# Altium schematic sheet TimerModule.SchDoc
size A1
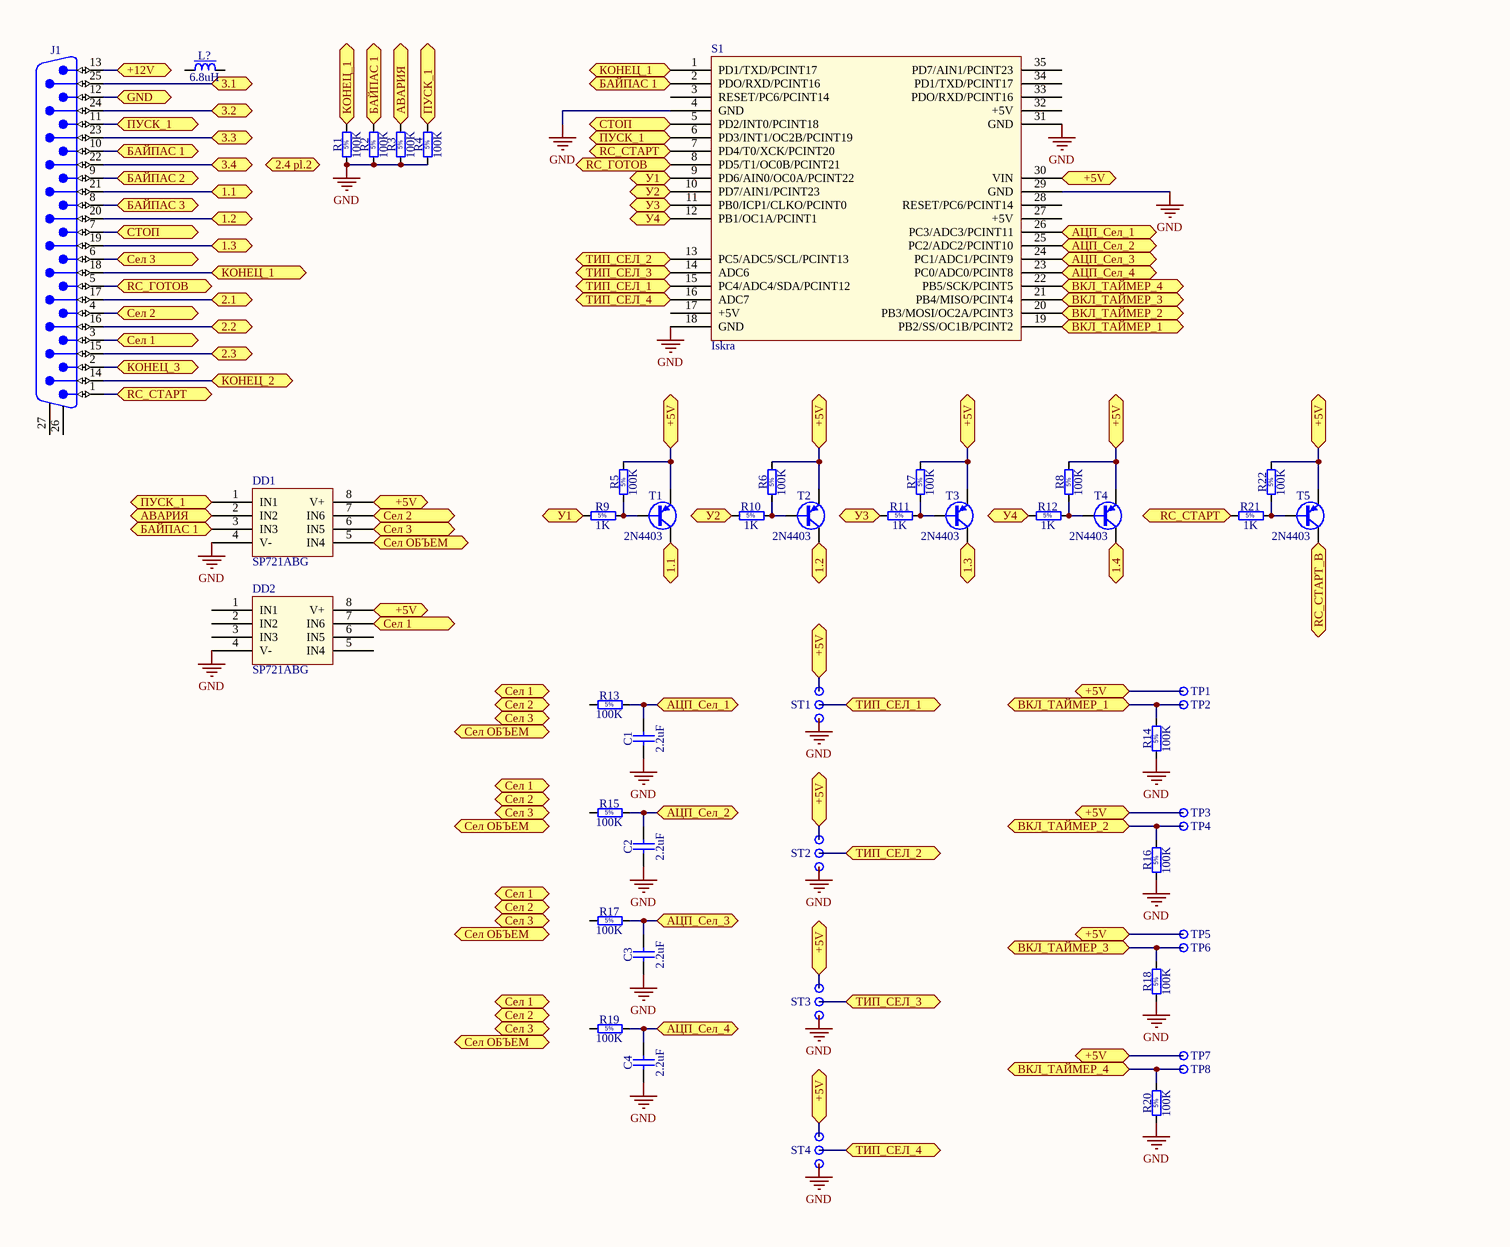
[diagram p0: TimerModule.SchDoc, left]
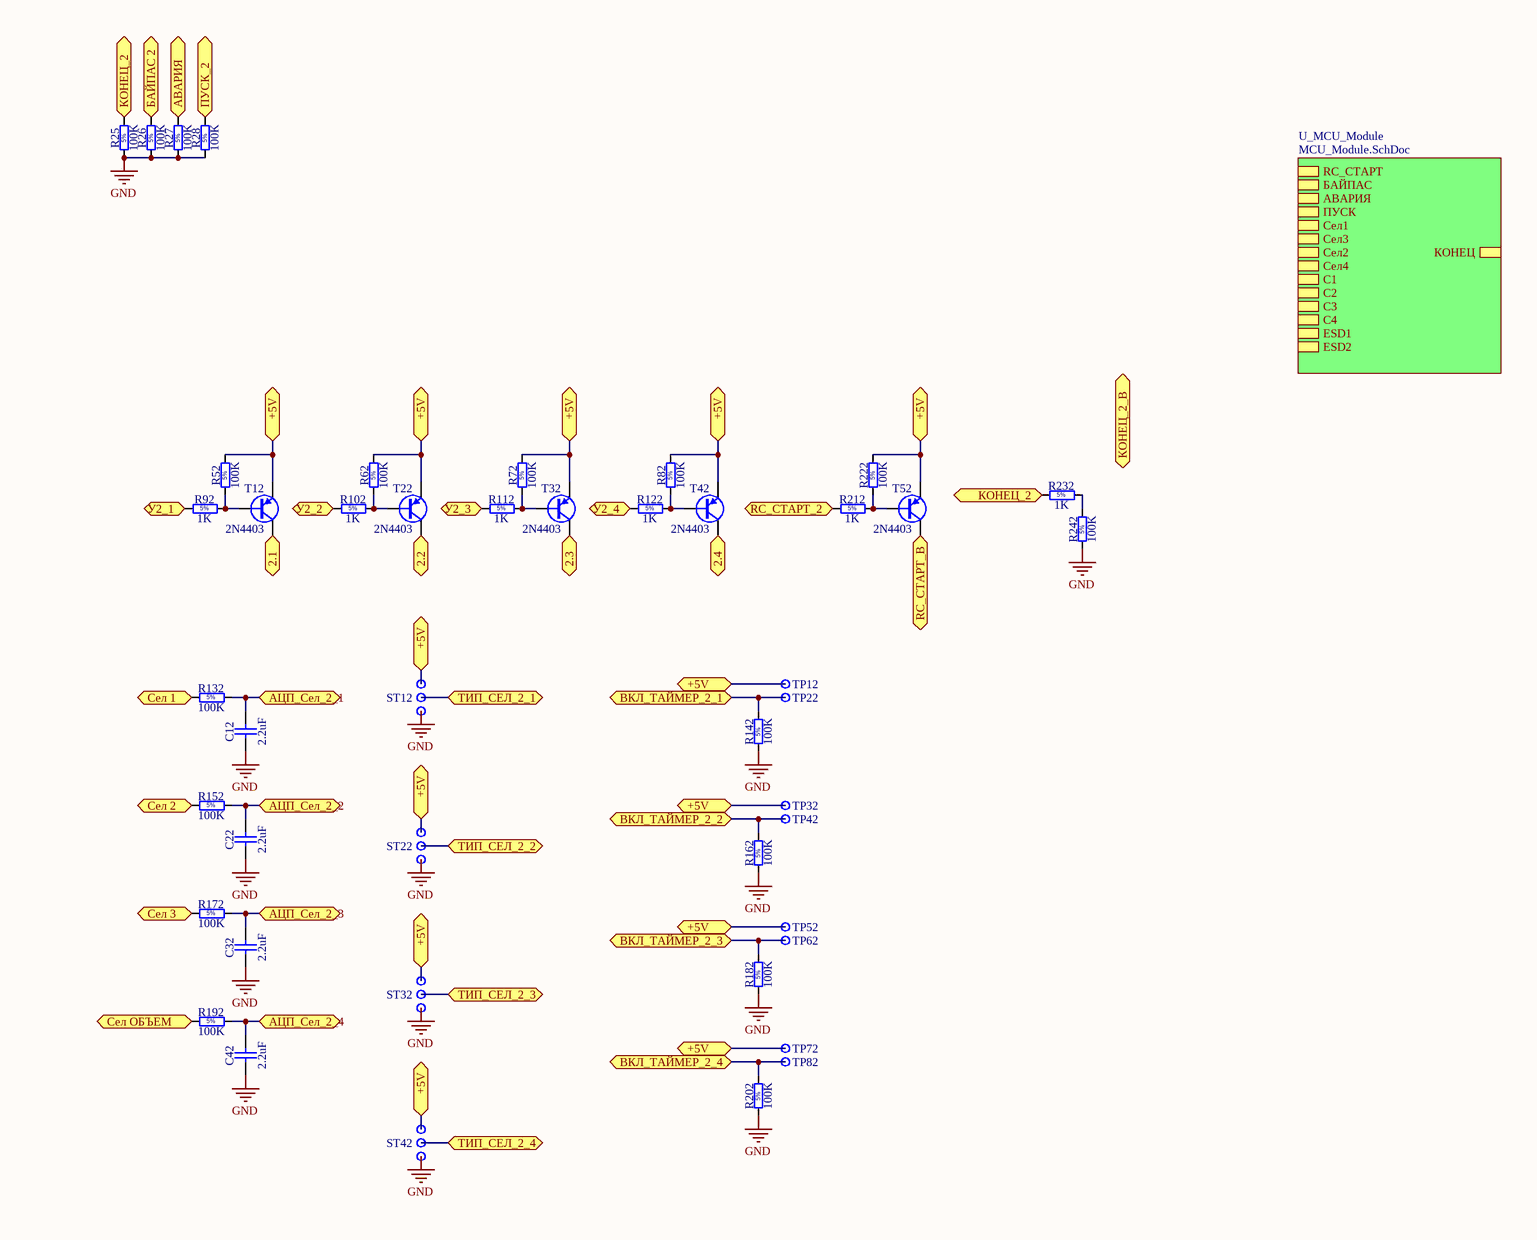
[diagram p1: TimerModule.SchDoc, right]

## Parts
B1  Plated Hole  [MTG300_700]  (value not drawn)
B2  Plated Hole  [MTG300_700]  (value not drawn)
B3  Plated Hole  [MTG300_700]  (value not drawn)
B4  Plated Hole  [MTG300_700]  (value not drawn)
B5  Plated Hole  [MTG300_700]  (value not drawn)
B6  Plated Hole  [MTG300_700]  (value not drawn)
B7  Plated Hole  [MTG300_700]  (value not drawn)
B8  Plated Hole  [MTG300_700]  (value not drawn)
B12  Plated Hole  [MTG300_700]  (value not drawn)
B22  Plated Hole  [MTG300_700]  (value not drawn)
B32  Plated Hole  [MTG300_700]  (value not drawn)
B42  Plated Hole  [MTG300_700]  (value not drawn)
B52  Plated Hole  [MTG300_700]  (value not drawn)
B62  Plated Hole  [MTG300_700]  (value not drawn)
B72  Plated Hole  [MTG300_700]  (value not drawn)
B82  Plated Hole  [MTG300_700]  (value not drawn)
C1  2.2uF  [CAPRR254-254X381X508]
C2  2.2uF  [CAPRR254-254X381X508]
C3  2.2uF  [CAPRR254-254X381X508]
C4  2.2uF  [CAPRR254-254X381X508]
C12  2.2uF  [CAPRR254-254X381X508]
C22  2.2uF  [CAPRR254-254X381X508]
C32  2.2uF  [CAPRR254-254X381X508]
C42  2.2uF  [CAPRR254-254X381X508]
DD1  SP721ABG  [SOIC127P594X363-8N]
DD2  SP721ABG  [SOIC127P594X363-8N]
J1  D-Sub  [AMPHENOL_L717DFB25P1ATN]  (value not drawn)
L?  6.8uH  [IND_WURTH_WE-TI]
R1  100K  [RES_ARCOL_RCC025]
R2  100K  [RES_ARCOL_RCC025]
R3  100K  [RES_ARCOL_RCC025]
R4  100K  [RES_ARCOL_RCC025]
R5  100K  [RES_ARCOL_RCC025]
R6  100K  [RES_ARCOL_RCC025]
R7  100K  [RES_ARCOL_RCC025]
R8  100K  [RES_ARCOL_RCC025]
R9  1K  [RES_ARCOL_RCC025]
R10  1K  [RES_ARCOL_RCC025]
R11  1K  [RES_ARCOL_RCC025]
R12  1K  [RES_ARCOL_RCC025]
R13  100K  [RES_ARCOL_RCC025]
R14  100K  [RES_ARCOL_RCC025]
R15  100K  [RES_ARCOL_RCC025]
R16  100K  [RES_ARCOL_RCC025]
R17  100K  [RES_ARCOL_RCC025]
R18  100K  [RES_ARCOL_RCC025]
R19  100K  [RES_ARCOL_RCC025]
R20  100K  [RES_ARCOL_RCC025]
R21  1K  [RES_ARCOL_RCC025]
R22  100K  [RES_ARCOL_RCC025]
R25  100K  [RES_ARCOL_RCC025]
R26  100K  [RES_ARCOL_RCC025]
R27  100K  [RES_ARCOL_RCC025]
R28  100K  [RES_ARCOL_RCC025]
R52  100K  [RES_ARCOL_RCC025]
R62  100K  [RES_ARCOL_RCC025]
R72  100K  [RES_ARCOL_RCC025]
R82  100K  [RES_ARCOL_RCC025]
R92  1K  [RES_ARCOL_RCC025]
R102  1K  [RES_ARCOL_RCC025]
R112  1K  [RES_ARCOL_RCC025]
R122  1K  [RES_ARCOL_RCC025]
R132  100K  [RES_ARCOL_RCC025]
R142  100K  [RES_ARCOL_RCC025]
R152  100K  [RES_ARCOL_RCC025]
R162  100K  [RES_ARCOL_RCC025]
R172  100K  [RES_ARCOL_RCC025]
R182  100K  [RES_ARCOL_RCC025]
R192  100K  [RES_ARCOL_RCC025]
R202  100K  [RES_ARCOL_RCC025]
R212  1K  [RES_ARCOL_RCC025]
R222  100K  [RES_ARCOL_RCC025]
R232  1K  [RES_ARCOL_RCC025]
R242  100K  [RES_ARCOL_RCC025]
S1  Iskra  [Iskra]
ST1  Plated Hole  [MTG300_700]  (value not drawn)
ST2  Plated Hole  [MTG300_700]  (value not drawn)
ST3  Plated Hole  [MTG300_700]  (value not drawn)
ST4  Plated Hole  [MTG300_700]  (value not drawn)
ST12  Plated Hole  [MTG300_700]  (value not drawn)
ST22  Plated Hole  [MTG300_700]  (value not drawn)
ST32  Plated Hole  [MTG300_700]  (value not drawn)
ST42  Plated Hole  [MTG300_700]  (value not drawn)
T1  2N4403  [TO-92AA-P254]
T2  2N4403  [TO-92AA-P254]
T3  2N4403  [TO-92AA-P254]
T4  2N4403  [TO-92AA-P254]
T5  2N4403  [TO-92AA-P254]
T12  2N4403  [TO-92AA-P254]
T22  2N4403  [TO-92AA-P254]
T32  2N4403  [TO-92AA-P254]
T42  2N4403  [TO-92AA-P254]
T52  2N4403  [TO-92AA-P254]
TP1  Test Point  [TPS127]  (value not drawn)
TP2  Test Point  [TPS127]  (value not drawn)
TP3  Test Point  [TPS127]  (value not drawn)
TP4  Test Point  [TPS127]  (value not drawn)
TP5  Test Point  [TPS127]  (value not drawn)
TP6  Test Point  [TPS127]  (value not drawn)
TP7  Test Point  [TPS127]  (value not drawn)
TP8  Test Point  [TPS127]  (value not drawn)
TP12  Test Point  [TPS127]  (value not drawn)
TP22  Test Point  [TPS127]  (value not drawn)
TP32  Test Point  [TPS127]  (value not drawn)
TP42  Test Point  [TPS127]  (value not drawn)
TP52  Test Point  [TPS127]  (value not drawn)
TP62  Test Point  [TPS127]  (value not drawn)
TP72  Test Point  [TPS127]  (value not drawn)
TP82  Test Point  [TPS127]  (value not drawn)

## Sub-sheets
U_MCU_Module = MCU_Module.SchDoc: RC_СТАРТ, БАЙПАС, АВАРИЯ, ПУСК, Сел1, Сел3, Сел2, Сел4, С1, С2, С3, С4, ESD1, ESD2, КОНЕЦ

## Ports
1.1, 1.2, 1.3, 1.4, 2.1, 2.2, 2.3, 2.4, 2.4 pl.2, 3.1, 3.2, 3.3, 3.4, +5V, +12V, GND, RC_ГОТОВ, RC_СТАРТ, RC_СТАРТ_2, RC_СТАРТ_В, АВАРИЯ, АЦП_Сел_1, АЦП_Сел_2, АЦП_Сел_2_1, АЦП_Сел_2_2, АЦП_Сел_2_3, АЦП_Сел_2_4, АЦП_Сел_3, АЦП_Сел_4, БАЙПАС 1, БАЙПАС 2, БАЙПАС 3, ВКЛ_ТАЙМЕР_1, ВКЛ_ТАЙМЕР_2, ВКЛ_ТАЙМЕР_2_1, ВКЛ_ТАЙМЕР_2_2, ВКЛ_ТАЙМЕР_2_3, ВКЛ_ТАЙМЕР_2_4, ВКЛ_ТАЙМЕР_3, ВКЛ_ТАЙМЕР_4, КОНЕЦ_1, КОНЕЦ_2, КОНЕЦ_2_В, КОНЕЦ_3, ПУСК_1, ПУСК_2, Сел 1, Сел 2, Сел 3, Сел ОБЪЕМ, СТОП, ТИП_СЕЛ_1, ТИП_СЕЛ_2, ТИП_СЕЛ_2_1, ТИП_СЕЛ_2_2, ТИП_СЕЛ_2_3, ТИП_СЕЛ_2_4, ТИП_СЕЛ_3, ТИП_СЕЛ_4, У1, У2, У2_1, У2_2, У2_3, У2_4, У3, У4

## Nets
GND: B2.1 B4.1 B6.1 B8.1 B22.1 B42.1 B62.1 B82.1 C1.1 C2.1 C3.1 C4.1 C12.1 C22.1 C32.1 C42.1 DD1.4(V-) DD2.4(V-) R1.1 R2.1 R3.1 R4.1 R14.1 R16.1 R18.1 R20.1 R25.1 R26.1 R27.1 R28.1 R142.1 R162.1 R182.1 R202.1 R242.1 S1.4(GND) S1.18(GND) S1.29(GND) S1.31(GND)
1.1: J1.21 T1.3(C) ; port 1.1
1.2: J1.20 T2.3(C) ; port 1.2
1.3: J1.19 T3.3(C) ; port 1.3
1.4: T4.3(C) ; port 1.4
2.1: J1.17 T12.3(C) ; port 2.1
2.2: J1.16 T22.3(C) ; port 2.2
2.3: J1.15 T32.3(C) ; port 2.3
2.4: T42.3(C) ; port 2.4
3.1: J1.25 ; port 3.1
3.2: J1.24 ; port 3.2
3.3: J1.23 ; port 3.3
3.4: J1.22 ; port 3.4
+5V: B1.1 B3.1 B5.1 B7.1 B12.1 B32.1 B52.1 B72.1 DD1.8(V+) DD2.8(V+) R5.2 R6.2 R7.2 R8.2 R22.2 R52.2 R62.2 R72.2 R82.2 R222.2 S1.30(VIN) T1.1(E) T2.1(E) T3.1(E) T4.1(E) T5.1(E) T12.1(E) T22.1(E) T32.1(E) T42.1(E) T52.1(E) TP1.1 TP3.1 TP5.1 TP7.1 TP12.1 TP32.1 TP52.1 TP72.1 ; port +5V
+12V: J1.13 ; port +12V
GND: J1.12 ; port GND  [a separate net that carries the same name]
RC_ГОТОВ: J1.5 S1.8(PD5/T1/OC0B/PCINT21) ; port RC_ГОТОВ
RC_СТАРТ: J1.1 R21.1 S1.7(PD4/T0/XCK/PCINT20) ; port RC_СТАРТ
RC_СТАРТ_2: R212.1 ; port RC_СТАРТ_2
RC_СТАРТ_В: T5.3(C) T52.3(C) ; port RC_СТАРТ_В
АВАРИЯ: DD1.2(IN2) R3.2 R27.2 ; port АВАРИЯ
АЦП_Сел_1: C1.2 R13.2 S1.26(PC3/ADC3/PCINT11) ; port АЦП_Сел_1
АЦП_Сел_2: C2.2 R15.2 S1.25(PC2/ADC2/PCINT10) ; port АЦП_Сел_2
АЦП_Сел_2_1: C12.2 R132.2 ; port АЦП_Сел_2_1
АЦП_Сел_2_2: C22.2 R152.2 ; port АЦП_Сел_2_2
АЦП_Сел_2_3: C32.2 R172.2 ; port АЦП_Сел_2_3
АЦП_Сел_2_4: C42.2 R192.2 ; port АЦП_Сел_2_4
АЦП_Сел_3: C3.2 R17.2 S1.24(PC1/ADC1/PCINT9) ; port АЦП_Сел_3
АЦП_Сел_4: C4.2 R19.2 S1.23(PC0/ADC0/PCINT8) ; port АЦП_Сел_4
БАЙПАС 1: DD1.3(IN3) J1.10 R2.2 S1.2(PDO/RXD/PCINT16) ; port БАЙПАС 1
БАЙПАС 2: J1.9 R26.2 ; port БАЙПАС 2
БАЙПАС 3: J1.8 ; port БАЙПАС 3
ВКЛ_ТАЙМЕР_1: R14.2 S1.19(PB2/SS/OC1B/PCINT2) TP2.1 ; port ВКЛ_ТАЙМЕР_1
ВКЛ_ТАЙМЕР_2: R16.2 S1.20(PB3/MOSI/OC2A/PCINT3) TP4.1 ; port ВКЛ_ТАЙМЕР_2
ВКЛ_ТАЙМЕР_2_1: R142.2 TP22.1 ; port ВКЛ_ТАЙМЕР_2_1
ВКЛ_ТАЙМЕР_2_2: R162.2 TP42.1 ; port ВКЛ_ТАЙМЕР_2_2
ВКЛ_ТАЙМЕР_2_3: R182.2 TP62.1 ; port ВКЛ_ТАЙМЕР_2_3
ВКЛ_ТАЙМЕР_2_4: R202.2 TP82.1 ; port ВКЛ_ТАЙМЕР_2_4
ВКЛ_ТАЙМЕР_3: R18.2 S1.21(PB4/MISO/PCINT4) TP6.1 ; port ВКЛ_ТАЙМЕР_3
ВКЛ_ТАЙМЕР_4: R20.2 S1.22(PB5/SCK/PCINT5) TP8.1 ; port ВКЛ_ТАЙМЕР_4
КОНЕЦ_1: J1.18 R1.2 S1.1(PD1/TXD/PCINT17) ; port КОНЕЦ_1
КОНЕЦ_2: J1.14 R25.2 R232.1 ; port КОНЕЦ_2
КОНЕЦ_3: J1.2 ; port КОНЕЦ_3
ПУСК_1: DD1.1(IN1) J1.11 R4.2 S1.6(PD3/INT1/OC2B/PCINT19) ; port ПУСК_1
ПУСК_2: R28.2 ; port ПУСК_2
Сел 1: DD2.7(IN6) J1.3 R132.1 ; port Сел 1
Сел 2: DD1.7(IN6) J1.4 R152.1 ; port Сел 2
Сел 3: DD1.6(IN5) J1.6 R172.1 ; port Сел 3
Сел ОБЪЕМ: DD1.5(IN4) R192.1 ; port Сел ОБЪЕМ
СТОП: J1.7 S1.5(PD2/INT0/PCINT18) ; port СТОП
ТИП_СЕЛ_1: S1.15(PC4/ADC4/SDA/PCINT12) ST1.1 ; port ТИП_СЕЛ_1
ТИП_СЕЛ_2: S1.13(PC5/ADC5/SCL/PCINT13) ST2.1 ; port ТИП_СЕЛ_2
ТИП_СЕЛ_2_1: ST12.1 ; port ТИП_СЕЛ_2_1
ТИП_СЕЛ_2_2: ST22.1 ; port ТИП_СЕЛ_2_2
ТИП_СЕЛ_2_3: ST32.1 ; port ТИП_СЕЛ_2_3
ТИП_СЕЛ_2_4: ST42.1 ; port ТИП_СЕЛ_2_4
ТИП_СЕЛ_3: S1.14(ADC6) ST3.1 ; port ТИП_СЕЛ_3
ТИП_СЕЛ_4: S1.16(ADC7) ST4.1 ; port ТИП_СЕЛ_4
У1: R9.1 S1.9(PD6/AIN0/OC0A/PCINT22) ; port У1
У2: R10.1 S1.10(PD7/AIN1/PCINT23) ; port У2
У2_1: R92.1 ; port У2_1
У2_2: R102.1 ; port У2_2
У2_3: R112.1 ; port У2_3
У2_4: R122.1 ; port У2_4
У3: R11.1 S1.11(PB0/ICP1/CLKO/PCINT0) ; port У3
У4: R12.1 S1.12(PB1/OC1A/PCINT1) ; port У4
NetR5_1: R5.1 R9.2 T1.2(B)
NetR6_1: R6.1 R10.2 T2.2(B)
NetR7_1: R7.1 R11.2 T3.2(B)
NetR8_1: R8.1 R12.2 T4.2(B)
NetR21_2: R21.2 R22.1 T5.2(B)
NetR52_1: R52.1 R92.2 T12.2(B)
NetR62_1: R62.1 R102.2 T22.2(B)
NetR72_1: R72.1 R112.2 T32.2(B)
NetR82_1: R82.1 R122.2 T42.2(B)
NetR212_2: R212.2 R222.1 T52.2(B)
NetR232_2: R232.2 R242.2

Not connected (* = marked no-connect by the designer): DD2 1(IN1) 2(IN2) 3(IN3) 5(IN4) 6(IN5); J1 26 27; L? 1 2; R13 1; R15 1; R17 1; R19 1; S1 3(RESET/PC6/PCINT14) 17(+5V) 27(+5V) 28(RESET/PC6/PCINT14) 32(+5V) 33(PDO/RXD/PCINT16) 34(PD1/TXD/PCINT17) 35(PD7/AIN1/PCINT23)

## Notes on the sheet
- (in symbol RCF_5K1_5%_0.25W_+10-6PPM_ARCOL_RCC025) 5%

## Library data of the parts
B1-B8 B12 B22 B32 B42 B52 B62 B72 B82 ST1-ST4 ST12 ST22 ST32 ST42 = PLATED_HOLE3.0_PAD7.0: Single Terminal Socket; Part Description: Plated Through Hole: Hole Dia.=3.0mm Pad Dia.=7.0mm; Mounted: No; Table: Pads; Part Number: PLATED_HOLE3.0_PAD7.0; Component Kind: Standard (No BOM); Component Type: Standard (No BOM); Pin Count: 1; Family: Plated Hole; Socket: No; SMD: No; Status: None; ComponentHeight: 0mm; Author: CERN DEM JLC; CreateDate: 26.05.2008; LatestRevisionDate: 26.05.2008; PackageDescription: Plated Through Hole: Hole Dia.=3.0mm Pad Dia.=7.0mm
C1-C4 C12 C22 C32 C42 = CCR_15PF_100V_5%_COG_254-254X381X508: Non-polarised capacitor; Part Description: Radial Lead Type Multilayer Ceramic Capacitor; Manufacturer: GENERIC; Manufacturer1 Part Number: SR151A150JAR; Voltage: 100VDC; TC: COG; Tolerance: ±5%; Table: Capacitors THD; Part Number: CCR_15PF_100V_5%_COG_254-254X381X508; Component Kind: Standard; Component Type: Standard; Pin Count: 2; Value: 2.2uF; Status: None; Manufacturer Part Number: CCR_15PF_100V_5%_COG_254-254X381X508; Case: LS2.54 W2.54 x L3.81 x H5.84; Mounted: Yes; Socket: No; SMD: No; ComponentHeight: 5.08mm; Manufacturer1 Example: AVX; Manufacturer1 ComponentHeight: 5.08mm; HelpURL: \\cern.ch\dfs\Applications\Altium\Datasheets\CCR_AVX_SR15.pdf; Author: CERN DEM JLC; CreateDate: 16.12.2010; LatestRevisionDate: 16.12.2010
J1 = AMPHENOL_L717DFB25P1ATN: Connector D-sub 25 Male; Part Description: Right Angled D-Sub 25 Male Contacts with Metal Bracket and Front Female Screwlock (UNC4-40); Part Number: AMPHENOL_L717DFB25P1ATN; Component Kind: Standard; Component Type: Standard; Pin Count: 27; Family: D-Sub; Mounted: Yes; Socket: No; SMD: No; Status: None; Manufacturer: AMPHENOL; Manufacturer Part Number: L717DFB25P1ATN; ComponentHeight: 13.4mm; HelpURL: \\cern.ch\dfs\Applications\Altium\Datasheets\AMPHENOL_L717DFB25P1ATN.pdf; Author: CERN DEM JLC; CreateDate: 03.06.2009; LatestRevisionDate: 14.07.2011; Table: AMPHENOL
L? = IND_6.8UH_20%_WURTH_WE-TI: Inductor With Magnetic core; Part Description: Radial Leaded Filter Choke Serie WE-TI; Manufacturer: WURTH ELEKTRONIK; Manufacturer Part Number: 744772068; Power: 3.8A; Resistance: 0.025R; Tolerance: ±20%; Table: Inductors THD; Part Number: IND_6.8UH_20%_WURTH_WE-TI; Component Kind: Standard; Component Type: Standard; Pin Count: 2; Value: 6.8uH; Case: LS5.08 H10 x D8.3; Mounted: Yes; Socket: No; SMD: No; ComponentHeight: 10mm; HelpURL: \\cern.ch\dfs\Applications\Altium\Datasheets\IND_WURTH_WE-TI_744772068.pdf; Author: CERN DEM JLC; CreateDate: 11.11.2008; LatestRevisionDate: 09.04.2014
R1-R22 R25-R28 R52 R62 R72 R82 R92 R102 R112 R122 R132 R142 R152 R162 R172 R182 R192 R202 R212 R222 R232 R242 = RCF_5K1_5%_0.25W_+10-6PPM_ARCOL_RCC025: Resistor - 5%; Part Description: Solid Carbon Resistor RCC Series; Manufacturer: ARCOL; Manufacturer Part Number: RCC025 5k1 J; Power: 0.25W; TC: +10-6ppm/°C; Table: Resistors THD; Part Number: RCF_5K1_5%_0.25W_+10-6PPM_ARCOL_RCC025; Component Kind: Standard; Component Type: Standard; Pin Count: 2; Status: None; Tolerance: ±5%; Case: LS10.16 L6.3 x D2.4; Mounted: Yes; Socket: No; SMD: No; ComponentHeight: 2.5mm; HelpURL: \\cern.ch\dfs\Applications\Altium\Datasheets\RCF_ARCOL_RCC025.pdf; Author: CERN DEM JLC; CreateDate: 30.10.2013; LatestRevisionDate: 30.10.2013
  R1-R8 R13-R20 R22 R25-R28 R52 R62 R72 R82 R132 R142 R152 R162 R172 R182 R192 R202 R222 R242: Value: 100K
  R9-R12 R21 R92 R102 R112 R122 R212 R232: Value: 1K
S1 = Iskra_Holder
T1-T5 T12 T22 T32 T42 T52 = 2N3906RL1G: PNP Transistor; Part Description: 40V 200mA PNP General Purpose Amplifier; Manufacturer: ON SEMICONDUCTOR; Table: Transistors; Part Number: 2N3906RL1G; Component Kind: Standard; Component Type: Standard; Device: 2N3906RL1G; PackageDescription: TO-92 (TO226), Pitch 2.54mm, Flat Index, 3 In-Line, Bent Leads, Body Dia. 5.3mm; Manufacturer Part Number: 2N3906RL1G; Pin Count: 3; Case: TO-92; Mounted: Yes; Socket: No; SMD: No; ComponentHeight: 7.7mm; HelpURL: \\cern.ch\dfs\Applications\Altium\Datasheets\2N3906RL1G.pdf; Author: CERN DEM JLC; CreateDate: 23.09.2009; LatestRevisionDate: 23.09.2009
TP1-TP8 TP12 TP22 TP32 TP42 TP52 TP62 TP72 TP82 = SMD_PAD_1.27X1.27MM: Part Description: 1.27mm x 1.27mm PCB Copper Area (SMD Test Point); Mounted: No; Table: Pads; Part Number: SMD_PAD_1.27X1.27MM; Component Kind: Standard (No BOM); Component Type: Standard (No BOM); Pin Count: 1; Family: Test Point; Socket: No; SMD: Yes; Status: None; ComponentHeight: 0mm; Author: CERN DEM JLC; CreateDate: 12.01.2008; LatestRevisionDate: 12.01.2008; PackageDescription: 1.27mm x 1.27mm PCB Copper Area (SMD Test Point)